# Altium schematic sheet Sheet_1.schdoc
size 191 x 246 mm
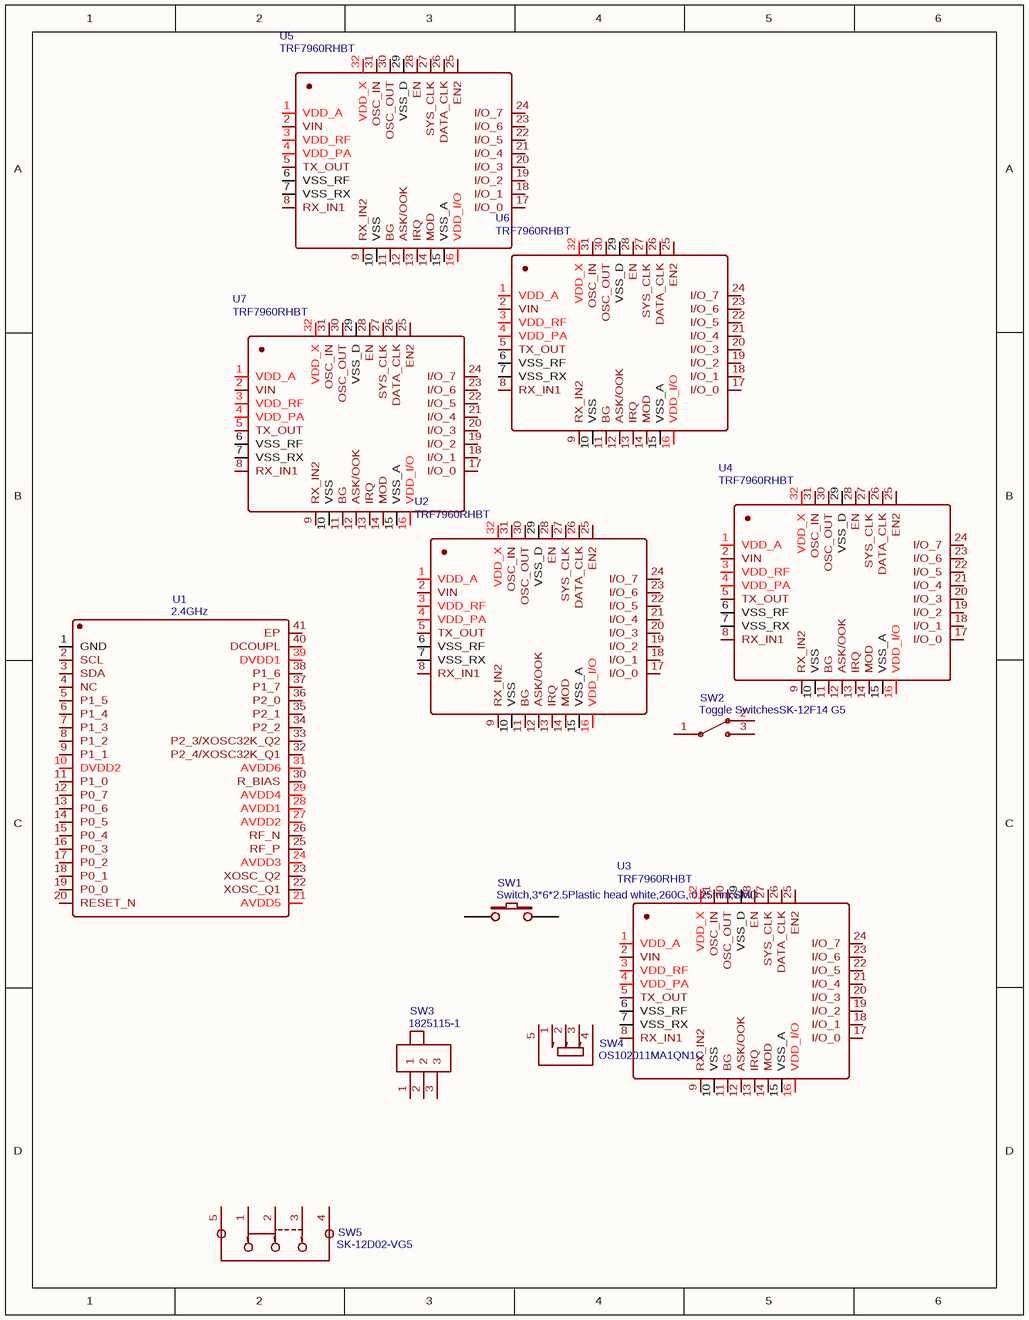
[diagram p0: Sheet_1.schdoc]

## Parts
SW1  Switch,3*6*2.5Plastic head white,260G, 0.25mm,SMD  [SWITCH-3X6X2.5_SMD]
SW2  Toggle SwitchesSK-12F14 G5  [SK-12F14-G]
SW3  1825115-1  [1825115-1]
SW4  OS102011MA1QN1C  [SW-DIP-8.6X4.4X4.7]
SW5  SK-12D02-VG5  [DIP-8.6X4.4]
U1  2.4GHz  [QFN-40_40PIN-L6.00-W6.00-PITCH0.50-EP-BL]
U2  TRF7960RHBT  [QFN-32_5X5X05P]
U3  TRF7960RHBT  [QFN-32_5X5X05P]
U4  TRF7960RHBT  [QFN-32_5X5X05P]
U5  TRF7960RHBT  [QFN-32_5X5X05P]
U6  TRF7960RHBT  [QFN-32_5X5X05P]
U7  TRF7960RHBT  [QFN-32_5X5X05P]

## Nets

Not connected (* = marked no-connect by the designer): SW1 1 2; SW2 1 2 3; SW3 1 2 3; SW4 1 2 3 4 5; SW5 1 2 3 4 5; U1 1(GND) 2(SCL) 3(SDA) 4(NC) 5(P1_5) 6(P1_4) 7(P1_3) 8(P1_2) 9(P1_1) 10(DVDD2) 11(P1_0) 12(P0_7) 13(P0_6) 14(P0_5) 15(P0_4) 16(P0_3) 17(P0_2) 18(P0_1) 19(P0_0) 20(RESET_N) 21(AVDD5) 22(XOSC_Q1) 23(XOSC_Q2) 24(AVDD3) 25(RF_P) 26(RF_N) 27(AVDD2) 28(AVDD1) 29(AVDD4) 30(R_BIAS) 31(AVDD6) 32(P2_4/XOSC32K_Q1) 33(P2_3/XOSC32K_Q2) 34(P2_2) 35(P2_1) 36(P2_0) 37(P1_7) 38(P1_6) 39(DVDD1) 40(DCOUPL) 41(EP); U2 1(VDD_A) 2(VIN) 3(VDD_RF) 4(VDD_PA) 5(TX_OUT) 6(VSS_RF) 7(VSS_RX) 8(RX_IN1) 9(RX_IN2) 10(VSS) 11(BG) 12(ASK/OOK) 13(IRQ) 14(MOD) 15(VSS_A) 16(VDD_I/O) 17(I/O_0) 18(I/O_1) 19(I/O_2) 20(I/O_3) 21(I/O_4) 22(I/O_5) 23(I/O_6) 24(I/O_7) 25(EN2) 26(DATA_CLK) 27(SYS_CLK) 28(EN) 29(VSS_D) 30(OSC_OUT) 31(OSC_IN) 32(VDD_X); U3 1(VDD_A) 2(VIN) 3(VDD_RF) 4(VDD_PA) 5(TX_OUT) 6(VSS_RF) 7(VSS_RX) 8(RX_IN1) 9(RX_IN2) 10(VSS) 11(BG) 12(ASK/OOK) 13(IRQ) 14(MOD) 15(VSS_A) 16(VDD_I/O) 17(I/O_0) 18(I/O_1) 19(I/O_2) 20(I/O_3) 21(I/O_4) 22(I/O_5) 23(I/O_6) 24(I/O_7) 25(EN2) 26(DATA_CLK) 27(SYS_CLK) 28(EN) 29(VSS_D) 30(OSC_OUT) 31(OSC_IN) 32(VDD_X); U4 1(VDD_A) 2(VIN) 3(VDD_RF) 4(VDD_PA) 5(TX_OUT) 6(VSS_RF) 7(VSS_RX) 8(RX_IN1) 9(RX_IN2) 10(VSS) 11(BG) 12(ASK/OOK) 13(IRQ) 14(MOD) 15(VSS_A) 16(VDD_I/O) 17(I/O_0) 18(I/O_1) 19(I/O_2) 20(I/O_3) 21(I/O_4) 22(I/O_5) 23(I/O_6) 24(I/O_7) 25(EN2) 26(DATA_CLK) 27(SYS_CLK) 28(EN) 29(VSS_D) 30(OSC_OUT) 31(OSC_IN) 32(VDD_X); U5 1(VDD_A) 2(VIN) 3(VDD_RF) 4(VDD_PA) 5(TX_OUT) 6(VSS_RF) 7(VSS_RX) 8(RX_IN1) 9(RX_IN2) 10(VSS) 11(BG) 12(ASK/OOK) 13(IRQ) 14(MOD) 15(VSS_A) 16(VDD_I/O) 17(I/O_0) 18(I/O_1) 19(I/O_2) 20(I/O_3) 21(I/O_4) 22(I/O_5) 23(I/O_6) 24(I/O_7) 25(EN2) 26(DATA_CLK) 27(SYS_CLK) 28(EN) 29(VSS_D) 30(OSC_OUT) 31(OSC_IN) 32(VDD_X); U6 1(VDD_A) 2(VIN) 3(VDD_RF) 4(VDD_PA) 5(TX_OUT) 6(VSS_RF) 7(VSS_RX) 8(RX_IN1) 9(RX_IN2) 10(VSS) 11(BG) 12(ASK/OOK) 13(IRQ) 14(MOD) 15(VSS_A) 16(VDD_I/O) 17(I/O_0) 18(I/O_1) 19(I/O_2) 20(I/O_3) 21(I/O_4) 22(I/O_5) 23(I/O_6) 24(I/O_7) 25(EN2) 26(DATA_CLK) 27(SYS_CLK) 28(EN) 29(VSS_D) 30(OSC_OUT) 31(OSC_IN) 32(VDD_X); U7 1(VDD_A) 2(VIN) 3(VDD_RF) 4(VDD_PA) 5(TX_OUT) 6(VSS_RF) 7(VSS_RX) 8(RX_IN1) 9(RX_IN2) 10(VSS) 11(BG) 12(ASK/OOK) 13(IRQ) 14(MOD) 15(VSS_A) 16(VDD_I/O) 17(I/O_0) 18(I/O_1) 19(I/O_2) 20(I/O_3) 21(I/O_4) 22(I/O_5) 23(I/O_6) 24(I/O_7) 25(EN2) 26(DATA_CLK) 27(SYS_CLK) 28(EN) 29(VSS_D) 30(OSC_OUT) 31(OSC_IN) 32(VDD_X)

## Library data of the parts
SW1 = Switch,3*6*2.5Plastic head white,260G, 0.25mm,SMD: BOM_Manufacturer: BBJ; BOM_Supplier Part: C71857; BOM_Supplier: LCSC; BOM_Manufacturer Part: Switch,3*6*2.5Plastic head white,260G, 0.25mm,SMD; spicePre: S
SW2 = Toggle SwitchesSK-12F14 G5: BOM_Manufacturer: ReliaPro; BOM_Supplier Part: C59902; BOM_Supplier: LCSC; BOM_Manufacturer Part: Toggle SwitchesSK-12F14 G5; image: http://image.lceda.cn/szlcsc/C59902.jpg; spicePre: S
SW3 = 1825115-1: BOM_Manufacturer: TE Connectivity; Contributor: LCSC; BOM_Supplier: LCSC; BOM_Supplier Part: C266201; BOM_Manufacturer Part: 1825115-1; spicePre: S
SW4 = OS102011MA1QN1C: BOM_Manufacturer: C&K; Contributor: LCSC; BOM_Supplier: LCSC; BOM_Supplier Part: C221828; BOM_Manufacturer Part: OS102011MA1QN1C; spicePre: S
SW5 = SK-12D02-VG5: BOM_Manufacturer: Rectangular Connectors - Contacts; Contributor: LCSC; BOM_Supplier: LCSC; BOM_Supplier Part: C136722; BOM_Manufacturer Part: SK-12D02-VG5; spicePre: S
U1 = 2.4GHz: BOM_Manufacturer: TI; BOM_Manufacturer Part: CC2541F256RHAR; nameAlias: Frequency; SMT Type: Extend; BOM_Supplier: LCSC; image: //image.lceda.cn/szlcsc/C22206.jpg; BOM_Supplier Part: C22206; BOM_LCSC Assembly: Yes; spicePre: U; spiceSymbolName: CC2541F256RHAR
U2-U7 = TRF7960RHBT: BOM_Manufacturer: Texas Instruments; Contributor: LCSC; BOM_Supplier: LCSC; BOM_Supplier Part: C77435; BOM_Manufacturer Part: TRF7960RHBT; spicePre: U